# Altium schematic sheet mcu.SchDoc
size A4; SheetNumber: 2; SheetTotal: 4
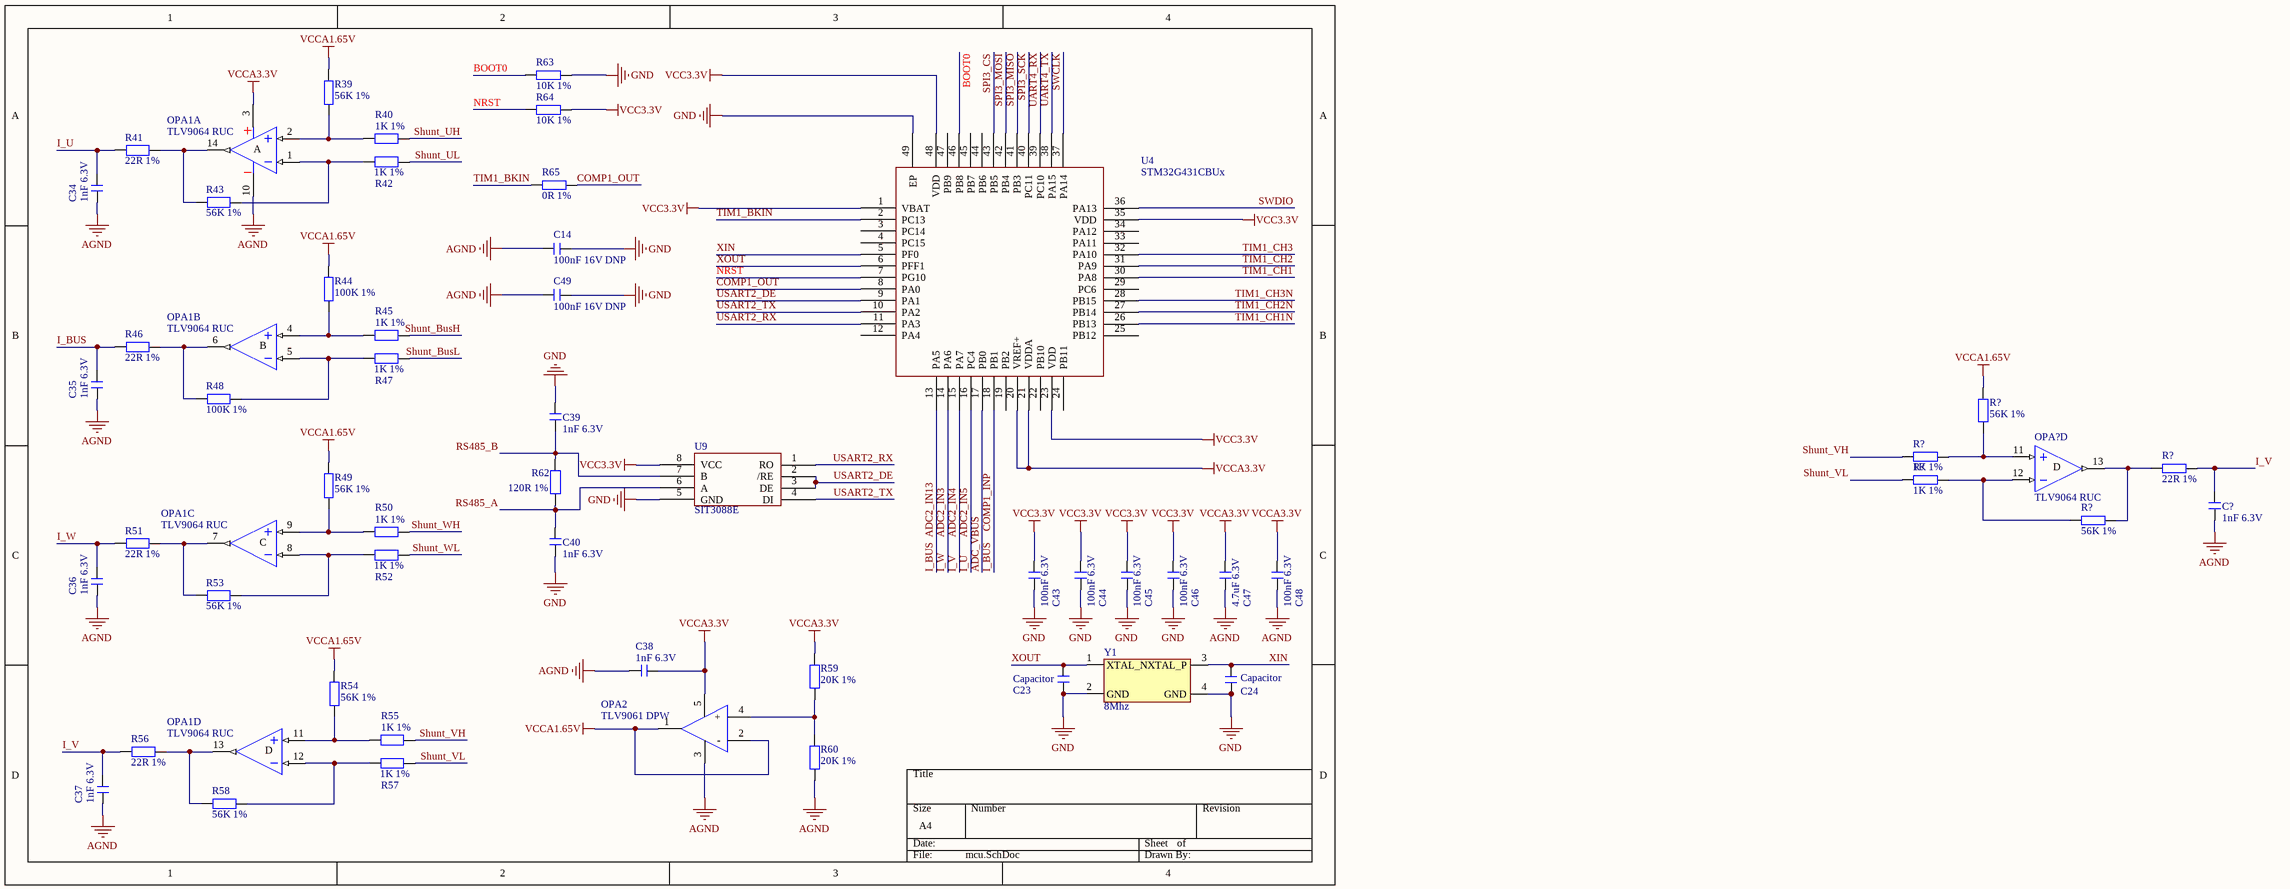
[diagram p0: mcu.SchDoc]

## Parts
(Parts that share a designator on the sheet are numbered #1, #2 ... from top to bottom, then left to right.)
C14  100nF 16V DNP  [C0603_L]
C23  Capacitor  [C0603_L]
C24  Capacitor  [C0603_L]
C34  1nF 6.3V  [C0603_L]
C35  1nF 6.3V  [C0603_L]
C36  1nF 6.3V  [C0603_L]
C37  1nF 6.3V  [C0603_L]
C38  1nF 6.3V  [C0603_L]
C39  1nF 6.3V  [C0603_L]
C40  1nF 6.3V  [C0603_L]
C43  100nF 6.3V  [C0603_L]
C44  100nF 6.3V  [C0603_L]
C45  100nF 6.3V  [C0603_L]
C46  100nF 6.3V  [C0603_L]
C47  4.7uF 6.3V  [C0603_L]
C48  100nF 6.3V  [C0603_L]
C49  100nF 16V DNP  [C0603_L]
C?  1nF 6.3V  [C0603_L]
OPA1  TLV9064 RUC  [TLV9064 RUC]  (parts A,B,C,D of 4)
OPA2  TLV9061 DPW  [X2SON-4_L0.8-W0.8-P0.48-TL-DPW]
OPA?  TLV9064 RUC  [TLV9064 RUC]  (part D of 4)
R39  56K 1%  [R0603_l]
R40  1K 1%  [R0603_l]
R41  22R 1%  [R0603_l]
R42  1K 1%  [R0603_l]
R43  56K 1%  [R0603_l]
R44  100K 1%  [R0603_l]
R45  1K 1%  [R0603_l]
R46  22R 1%  [R0603_l]
R47  1K 1%  [R0603_l]
R48  100K 1%  [R0603_l]
R49  56K 1%  [R0603_l]
R50  1K 1%  [R0603_l]
R51  22R 1%  [R0603_l]
R52  1K 1%  [R0603_l]
R53  56K 1%  [R0603_l]
R54  56K 1%  [R0603_l]
R55  1K 1%  [R0603_l]
R56  22R 1%  [R0603_l]
R57  1K 1%  [R0603_l]
R58  56K 1%  [R0603_l]
R59  20K 1%  [R0603_l]
R60  20K 1%  [R0603_l]
R62  120R 1%  [R0603_l]
R63  10K 1%  [R0603_l]
R64  10K 1%  [R0603_l]
R65  0R 1%  [R0603_l]
R?#1  56K 1%  [R0603_l]
R?#2  1K 1%  [R0603_l]
R?#3  22R 1%  [R0603_l]
R?#4  1K 1%  [R0603_l]
R?#5  56K 1%  [R0603_l]
U4  STM32G431CBUx  [QFN48 7X7_M]
U9  SIT3088E  [DFN-8_L3.0-W3.0-P0.65-BL-EP]
Y1  8Mhz  [OSC 3225-4P]

## Nets
AGND: C14.2 C34.1 C35.1 C36.1 C37.1 C38.1 C47.1 C48.1 C49.2 C?.1 OPA1.10(V-) OPA2.3(V-) R60.2
GND: C14.1 C23.2 C24.2 C39.2 C40.1 C43.1 C44.1 C45.1 C46.1 C49.1 R63.1 U4.49(EP) U9.5(GND) Y1.2(GND) Y1.4(GND)
VCC3.3V: C43.2 C44.2 C45.2 C46.2 R64.1 U4.1(VBAT) U4.23(VDD) U4.35(VDD) U4.48(VDD) U9.8(VCC)
VCCA1.65V: OPA2.1(OUT1) OPA2.2(-) R39.2 R44.2 R49.2 R54.2 R?#1.2
VCCA3.3V: C38.2 C47.2 C48.2 OPA1.3(V+) OPA2.5(V+) R59.1 U4.20(VREF+) U4.21(VDDA)
ADC2_IN3: C36.2 R51.1 U4.14(PA6)  [also labelled I_W]
ADC2_IN4: C37.2 C?.2 R56.1 R?#3.1 U4.15(PA7)  [also labelled I_V]
ADC2_IN5: C34.2 R41.1 U4.16(PC4)  [also labelled I_U]
ADC2_IN13: C35.2 R46.1 U4.13(PA5) U4.18(PB1)  [also labelled COMP1_INP, I_BUS]
ADC_VBUS: U4.17(PB0)
BOOT0: R63.2 U4.46(PB8)
COMP1_OUT: R65.1 U4.8(PA0)
NRST: R64.2 U4.7(PG10)
RS485_A: C40.2 R62.1 U9.6(A)
RS485_B: C39.1 R62.2 U9.7(B)
Shunt_BusH: R45.2
Shunt_BusL: R47.2
Shunt_UH: R40.2
Shunt_UL: R42.2
Shunt_VH: R55.2 R?#2.2
Shunt_VL: R57.2 R?#4.2
Shunt_WH: R50.2
Shunt_WL: R52.2
SPI3_CS: U4.43(PB5)
SPI3_MISO: U4.41(PB3)
SPI3_MOSI: U4.42(PB4)
SPI3_SCK: U4.40(PC11)
SWCLK: U4.37(PA14)
SWDIO: U4.36(PA13)
TIM1_BKIN: R65.2 U4.2(PC13)
TIM1_CH1: U4.30(PA8)
TIM1_CH1N: U4.26(PB13)
TIM1_CH2: U4.31(PA9)
TIM1_CH2N: U4.27(PB14)
TIM1_CH3: U4.32(PA10)
TIM1_CH3N: U4.28(PB15)
UART4_RX: U4.39(PC10)
UART4_TX: U4.38(PA15)
USART2_DE: U4.9(PA1) U9.2(/RE) U9.3(DE)
USART2_RX: U4.11(PA3) U9.1(RO)
USART2_TX: U4.10(PA2) U9.4(DI)
XIN: C24.1 U4.5(PF0) Y1.3(XTAL_P)
XOUT: C23.1 U4.6(PFF1) Y1.1(XTAL_N)
NetOPA1_1: OPA1.1(IN-) R42.1 R43.1
NetOPA1_2: OPA1.2(IN+) R39.1 R40.1
NetOPA1_4: OPA1.4(IN+) R44.1 R45.1
NetOPA1_5: OPA1.5(IN-) R47.1 R48.1
NetOPA1_6: OPA1.6(OUT) R46.2 R48.2
NetOPA1_7: OPA1.7(OUT) R51.2 R53.2
NetOPA1_8: OPA1.8(IN-) R52.1 R53.1
NetOPA1_9: OPA1.9(IN+) R49.1 R50.1
NetOPA1_11: OPA1.11(IN+) R54.1 R55.1
NetOPA1_12: OPA1.12(IN-) R57.1 R58.1
NetOPA1_13: OPA1.13(OUT) R56.2 R58.2
NetOPA1_14: OPA1.14(OUT) R41.2 R43.2
NetOPA2_4: OPA2.4(+) R59.2 R60.1
NetOPA?_11: OPA?.11(IN+) R?#1.1 R?#2.1
NetOPA?_12: OPA?.12(IN-) R?#4.1 R?#5.1
NetOPA?_13: OPA?.13(OUT) R?#3.2 R?#5.2

Not connected (* = marked no-connect by the designer): U4 3(PC14) 4(PC15) 12(PA4) 19(PB2) 22(PB10) 24(PB11) 25(PB12) 29(PC6) 33(PA11) 34(PA12) 44(PB6) 45(PB7) 47(PB9)

## Notes on the sheet
- (in symbol TLV9064 RUC, part A) A
- (in symbol TLV9064 RUC, part B) B
- (in symbol TLV9064 RUC, part C) C
- (in symbol TLV9064 RUC, part D) D

## Library data of the parts
C14 C34-C40 C43-C49 C? = C-MLCC: 独石电容; 版权归属: 源创客; BOM名称: 独石电容; 学习资源: www.ooocke.com
C23 C24 = C: 无极性贴片电容; 版权归属: 源创客; 材质: X7R; BOM名称: 无极性贴片电容; 学习资源: www.ooocke.com
OPA1 OPA? = TLV9064 RUC: 4路运放 14 引脚 X2QFN; 版权归属: 源创客; BOM名称: 4路运放; 学习资源: www.ooocke.com
OPA2 = TLV9061 DPW: TLV9061 DPW单路运放
R39-R60 R62-R65 R?#1-R?#5 = R: 贴片电阻; 版权归属: 源创客; BOM名称: 贴片电阻; 学习资源: www.ooocke.com
U9 = SIT3088E: RS485/RS422收发器
Y1 = Crystal